# EAGLE design newbettershield (EAGLE 8.6.3)
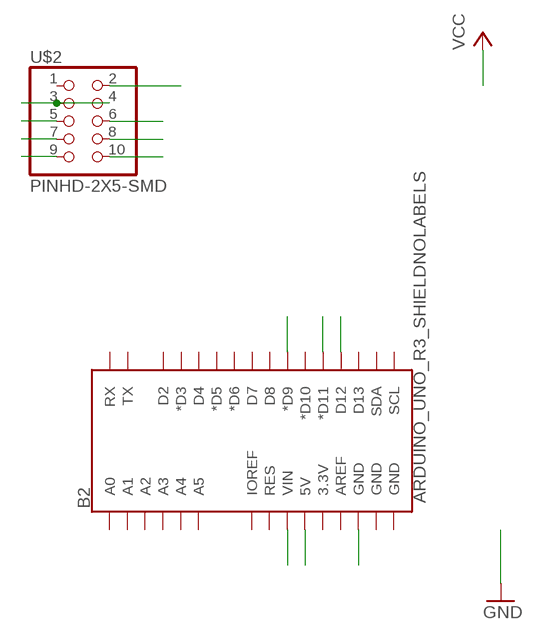
[diagram p0: schematic, sheet 1]

## Parts
B2  ARDUINO_UNO_R3_SHIELDNOLABELS  [UNO_R3_SHIELD_NOLABELS]
U$2  PINHD-2X5-SMD  [2X05SMD]

## Nets
5V: B2.5V U$2.9
ECHO: B2.D11(*D11) U$2.5
GND: B2.GND@2(GND) U$2.2 U$2.3 U$2.4
SERVO1: B2.D9(*D9) U$2.6
TRIGGER: B2.D12 U$2.7
VCC: B2.VIN U$2.8 U$2.10
Unconnected: B2.3.3V B2.A0 B2.A1 B2.A2 B2.A3 B2.A4 B2.A5 B2.AREF B2.D2 B2.D3(*D3) B2.D4 B2.D5(*D5) B2.D6(*D6) B2.D7 B2.D8 B2.D10(*D10) B2.D13 B2.GND@0(GND) B2.GND@1(GND) B2.IOREF B2.RES B2.RX B2.SCL B2.SDA B2.TX U$2.1

## Library data of the parts
B2 = SparkFun-Boards:ARDUINO_UNO_R3_SHIELD: Arduino R3 Shield Footprint Shield form compatible with the Arduino Uno R3. SparkFun Products: MG2639 Cellular Shield <https://www.sparkfun.com/products/13120> MIDI Shield <https://www.sparkfun.com/products/12898> R3 Stackable Headers Kit <https://www.sparkfun.com/products/11417>
U$2 = fab:PINHD-2X5-SMD

## Board
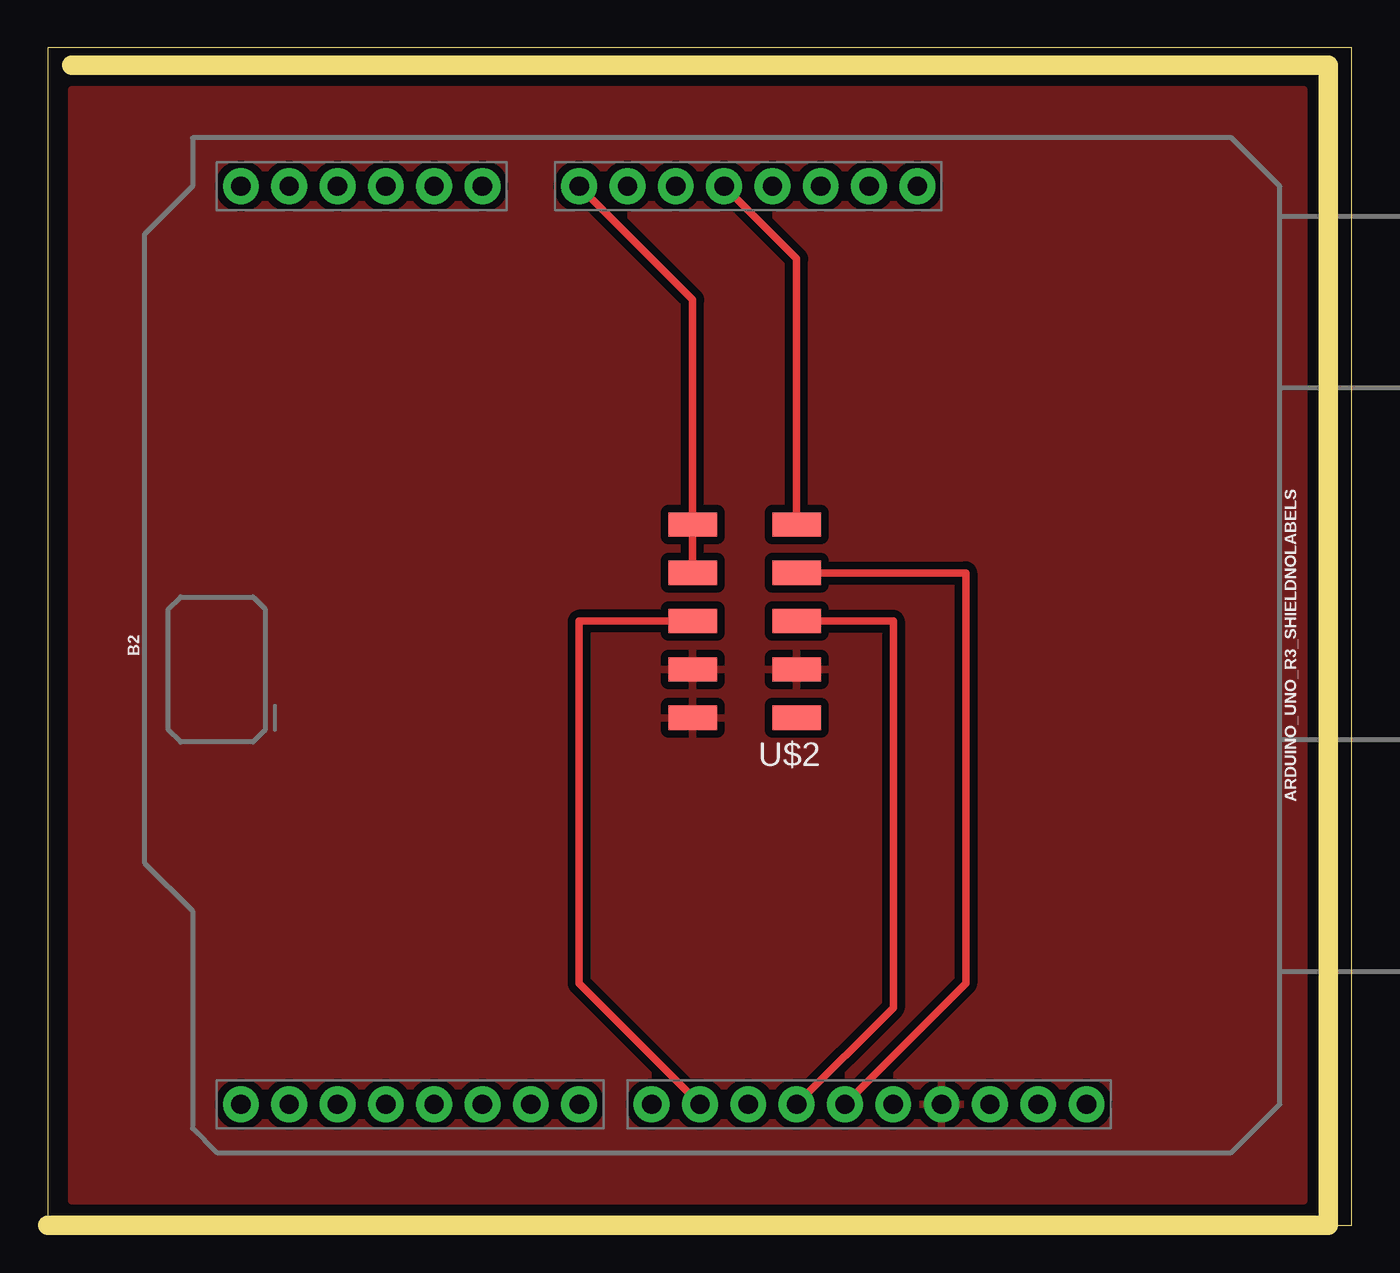
[diagram p1: board, top side]

Size 68.56 x 61.9 mm. Coordinates in mm from the lower left corner, seen from the top.
Outline: 0,0 68.56,0 68.56,61.9 0,61.9 0,0
Copper layers (1*16): Top 0.035mm / dielectric 1.5mm / Bottom 0.035mm
Design rules "default *": minimum track width 16mil, minimum drill 0.35mm, track to track 16mil, track to pad 16mil, pad to pad 16mil, via to via 16mil, smd to smd 16mil, copper to edge 40mil, drill to drill 6mil, minimum pad ring 10mil, minimum via ring 8mil, stop-mask expansion 4mil, vias tented up to drill 0mil, thermal gap 16mil
Milling: 3 lines

### Footprints (pad centres in the part's own frame; a part is rotated, then mirrored left to right if it is on the bottom)
UNO_R3_SHIELD_NOLABELS = drill 1.016 pad 1.88: 3.3V 24.13,-3.81; 5V 24.13,-1.27; A0 24.13,11.43; A1 24.13,13.97; A2 24.13,16.51; A3 24.13,19.05; A4 24.13,21.59; A5 24.13,24.13; AREF -24.13,-15.24; D2 -24.13,19.05; D3 -24.13,16.51; D4 -24.13,13.97; D5 -24.13,11.43; D6 -24.13,8.89; D7 -24.13,6.35; D8 -24.13,2.54; D9 -24.13,0; D10 -24.13,-2.54; D11 -24.13,-5.08; D12 -24.13,-7.62; D13 -24.13,-10.16; GND@0 24.13,1.27; GND@1 24.13,3.81; GND@2 -24.13,-12.7; IOREF 24.13,-8.89; NC 24.13,-11.43; RES 24.13,-6.35; RX -24.13,24.13; SCL -24.13,-20.32; SDA -24.13,-17.78; TX -24.13,21.59; VIN 24.13,6.35
2X05SMD = smd 2.54 x 1.27: 1 -2.54,2.54; 2 2.92,2.54; 3 -2.54,0; 4 2.92,0; 5 -2.54,-2.54; 6 2.92,-2.54; 7 -2.54,-5.08; 8 2.92,-5.08; 9 -2.54,-7.62; 10 2.92,-7.62

### Placement (x,y rotation side)
B2  34.29,30.48 90 top
U$2  36.83,29.21 180 top

### Tracks (layer width: path | path; a pad name or v marks a point on that pad's centre or on a via)
5V
  Top 0.406: U$2.9 39.37,50.8 B2.5V
ECHO
  Top 0.406: U$2.5 44.45,31.75 44.45,11.43 B2.D11
GND
  pour Top: 1.27,59.69 1.27,1.27 66.04,1.27 66.04,59.69
SERVO1
  Top 0.406: U$2.6 27.94,31.75 27.94,12.7 B2.D9
TRIGGER
  Top 0.406: U$2.7 48.26,34.29 48.26,12.7 B2.D12
VCC
  Top 0.406: B2.VIN 33.91,48.64 U$2.10 U$2.8